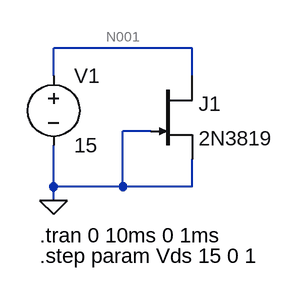
[diagram p0: schematic Draft1.asc]
Draft1.asc, the LTspice schematic file:
Version 4
SHEET 1 880 680
WIRE 224 80 64 80
WIRE 64 112 64 80
WIRE 224 112 224 80
WIRE 176 176 144 176
WIRE 64 240 64 192
WIRE 144 240 144 176
WIRE 144 240 64 240
WIRE 224 240 224 208
WIRE 224 240 144 240
WIRE 64 256 64 240
FLAG 64 256 0
SYMBOL njf 176 112 R0
SYMATTR InstName J1
SYMATTR Value 2N3819
SYMBOL voltage 64 96 R0
WINDOW 123 0 0 Left 0
WINDOW 39 0 0 Left 0
SYMATTR InstName V1
SYMATTR Value 15
TEXT 48 296 Left 2 !.tran 0 10ms 0 1ms
TEXT 48 320 Left 2 !.step param Vds 15 0 1

The netlist it stands for:
* Draft1.asc
J1 N001 0 0 2N3819
V1 N001 0 15
.model NJF NJF
.model PJF PJF
.lib standard.jft
.tran 0 10ms 0 1ms
.step param Vds 15 0 1
.backanno
.end

* Results of the author's LTspice run, read from the files saved beside the schematic
* Operating Point (first step), zero values left out:
*   V(n001) = 15 V
*   Id(J1) = 12.03 mA
*   Ig(J1) = -16.06 pA
*   Is(J1) = -12.03 mA
*   I(V1) = -12.03 mA